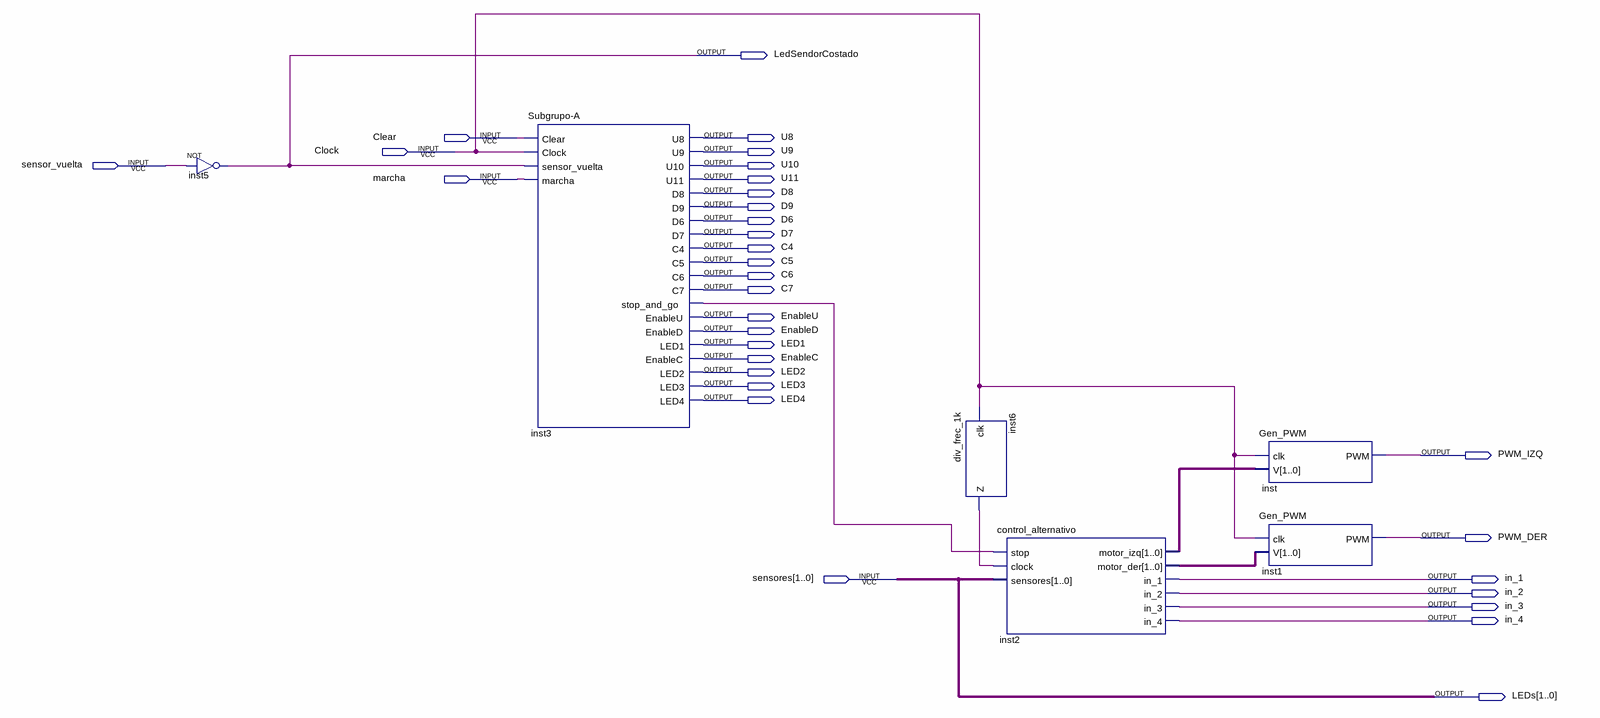
[diagram p0: schematic sheet]
// Quartus schematic Subgrupo-B.bdf as structural Verilog: 6 symbols, 32 pins
module \Subgrupo-B  (
  input  Clear,
  input  Clock,
  input  sensor_vuelta,
  input  marcha,
  input  [1:0] sensores,
  output LedSendorCostado,
  output U8,
  output U9,
  output U10,
  output U11,
  output D8,
  output D9,
  output D6,
  output D7,
  output C4,
  output C5,
  output C6,
  output C7,
  output EnableU,
  output EnableD,
  output LED1,
  output EnableC,
  output LED2,
  output LED3,
  output LED4,
  output PWM_IZQ,
  output PWM_DER,
  output in_1,
  output in_2,
  output in_3,
  output in_4,
  output [1:0] LEDs
);

  wire inst3_stop_and_go, inst6_z;
  wire [1:0] inst2_motor_der, inst2_motor_izq;

  not inst5 (LedSendorCostado, sensor_vuelta);
  \Subgrupo-A  inst3 (
    .Clear(Clear), .Clock(Clock), .sensor_vuelta(LedSendorCostado), .marcha(marcha), .U8(U8), .U9(U9),
    .U10(U10), .U11(U11), .D8(D8), .D9(D9), .D6(D6), .D7(D7), .C4(C4), .C5(C5), .C6(C6), .C7(C7),
    .stop_and_go(inst3_stop_and_go), .EnableU(EnableU), .EnableD(EnableD), .LED1(LED1), .EnableC(EnableC),
    .LED2(LED2), .LED3(LED3), .LED4(LED4));
  div_frec_1k inst6 (.clk(Clock), .Z(inst6_z));
  control_alternativo inst2 (
    .stop(inst3_stop_and_go), .clock(inst6_z), .sensores(sensores), .motor_izq(inst2_motor_izq),
    .motor_der(inst2_motor_der), .in_1(in_1), .in_2(in_2), .in_3(in_3), .in_4(in_4));
  Gen_PWM inst (.clk(Clock), .V(inst2_motor_izq), .PWM(PWM_IZQ));
  Gen_PWM inst1 (.clk(Clock), .V(inst2_motor_der), .PWM(PWM_DER));

  assign LEDs = sensores;
endmodule
